# Altium schematic sheet System Overview.SchDoc
size A4; SheetNumber: 1; SheetTotal: 4
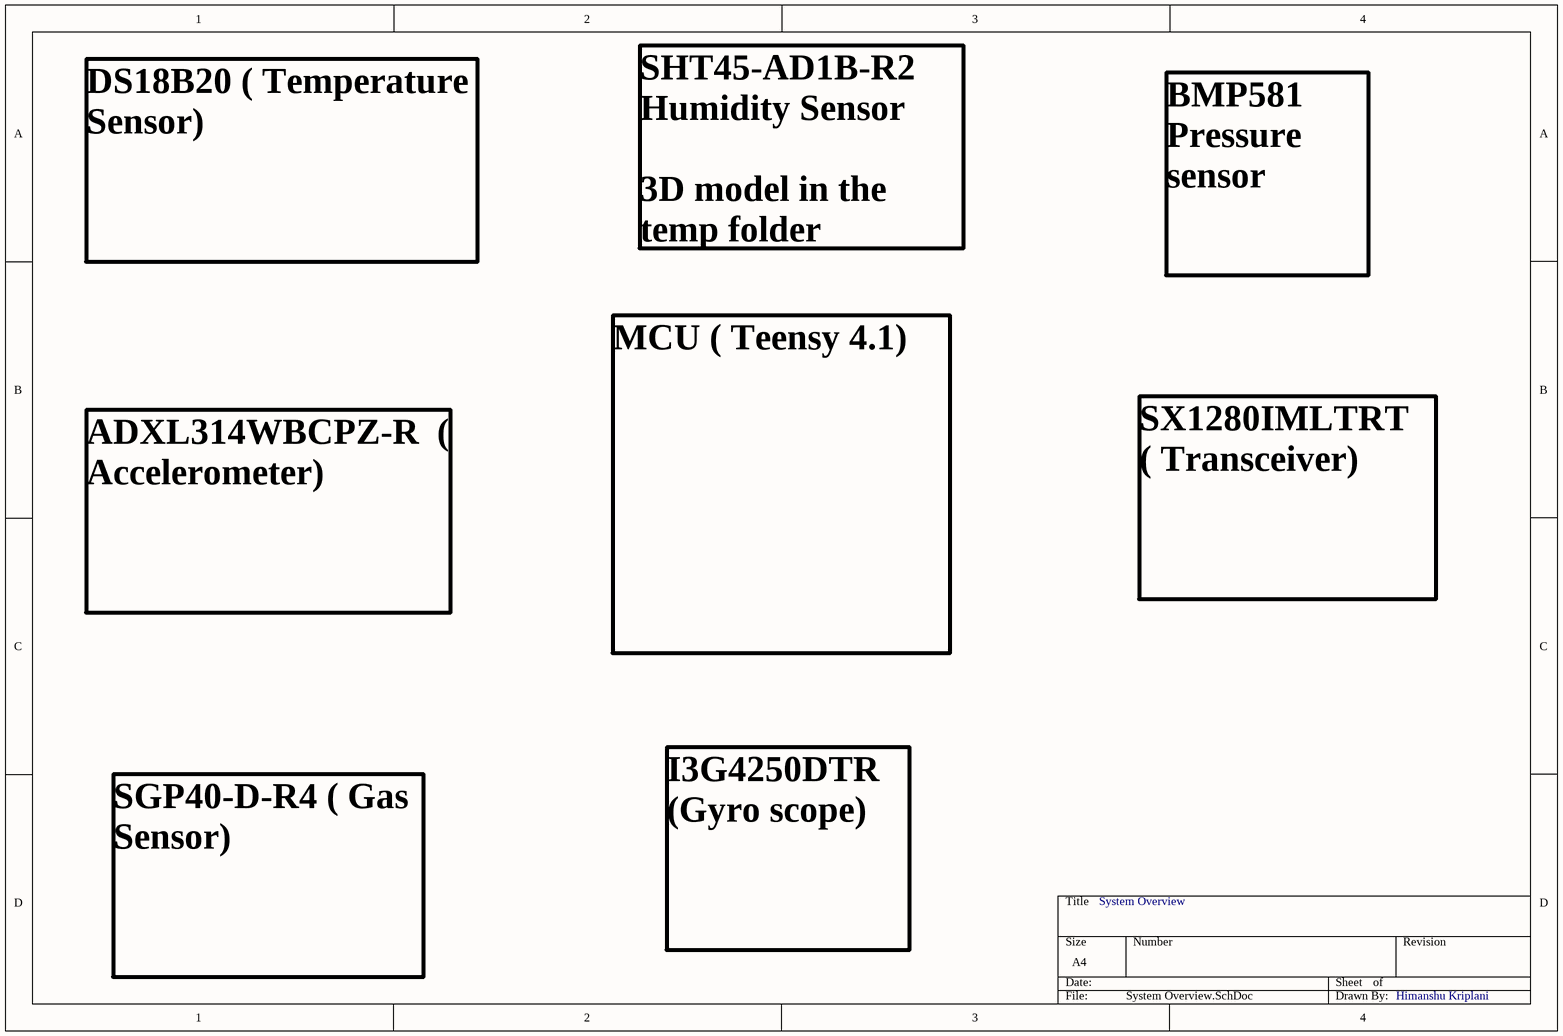
[diagram p0: System Overview.SchDoc]

## Notes on the sheet
- SHT45-AD1B-R2
  Humidity Sensor
  3D model in the temp folder
- DS18B20 ( Temperature Sensor)
- BMP581 Pressure sensor
- ADXL314WBCPZ-R  ( Accelerometer)
- MCU ( Teensy 4.1)
- SX1280IMLTRT  ( Transceiver)
- System Overview
- SGP40-D-R4 ( Gas Sensor)
- I3G4250DTR  (Gyro scope)
- Himanshu Kriplani